# Altium schematic sheet Interrupter.SchDoc
size A3
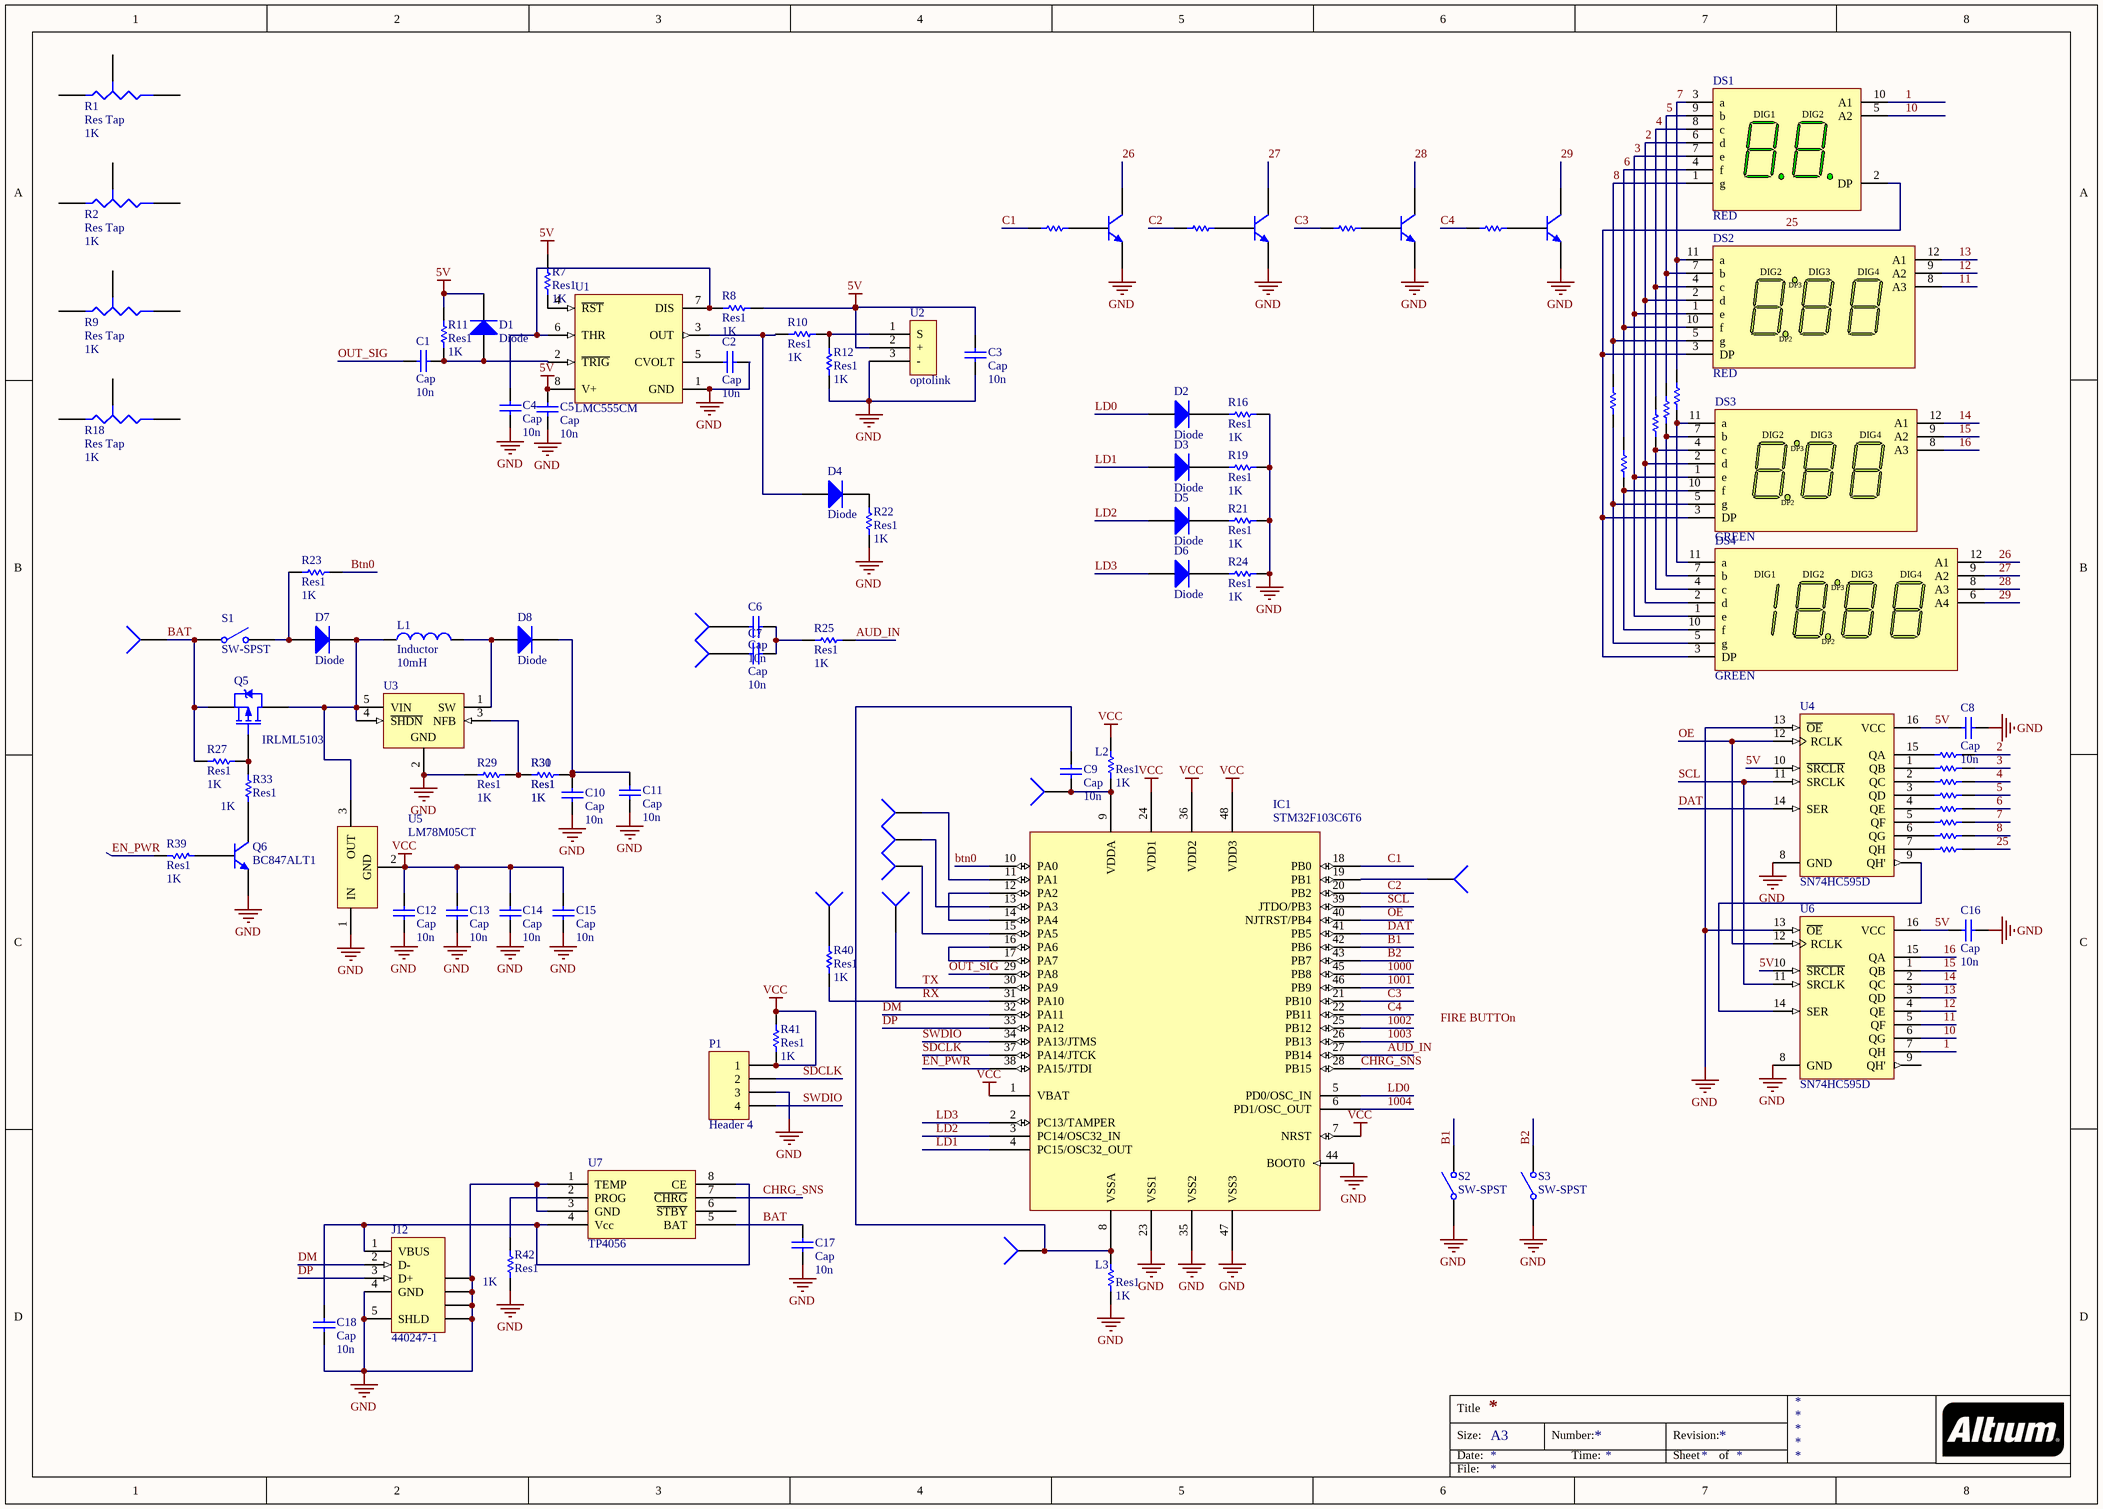
[diagram p0: Interrupter.SchDoc]

## Parts
C1  Cap  value 10n  [0805x]
C2  Cap  value 10n  [ERA-0603]
C3  Cap  value 10n  [1206xx]
C4  Cap  value 10n  [ERA-0603]
C5  Cap  value 10n  [ERA-0603]
C6  Cap  value 10n  [ERA-0603]
C7  Cap  value 10n  [ERA-0603]
C8  Cap  value 10n  [0402]
C9  Cap  value 10n  [0805x]
C10  Cap  value 10n  [1206xx]
C11  Cap  value 10n  [ERA-0603]
C12  Cap  value 10n  [1206x]
C13  Cap  value 10n  [0402]
C14  Cap  value 10n  [0402]
C15  Cap  value 10n  [0402]
C16  Cap  value 10n  [0402]
C17  Cap  value 10n  [1206xx]
C18  Cap  value 10n  [1206xx]
D1  Diode  [SOD80C]
D2  Diode  [LED3mm]
D3  Diode  [LED3mm]
D4  Diode  [LED3mm]
D5  Diode  [LED3mm]
D6  Diode  [LED3mm]
D7  Diode  [SOD80C]
D8  Diode  [SOD80C]
DS1  RED  [HDSM-577]
DS2  RED  [7seg_3x_small]
DS3  GREEN  [7SEG_3X_MEDIUM]
DS4  GREEN  [7seg_4x_small]
IC1  STM32F103C6T6  [TQFP48_N]
J1  Socket  [PAD]  (value not drawn)
J2  Socket  [PAD]  (value not drawn)
J3  Socket  [PAD]  (value not drawn)
J4  Socket  [PAD]  (value not drawn)
J5  Socket  [PAD]  (value not drawn)
J6  Socket  [PAD]  (value not drawn)
J7  Socket  [PAD]  (value not drawn)
J8  Socket  [PAD]  (value not drawn)
J9  Socket  [PAD]  (value not drawn)
J10  Socket  [PAD]  (value not drawn)
J11  Socket  [PAD]  (value not drawn)
J12  440247-1  [440247]
L1  Inductor  value 10mH  [IND_SMD_1]
L2  Res1  value 1K  [ERA-0603]
L3  Res1  value 1K  [ERA-0603]
P1  Header 4  [MHDR1X4]
Q1  BC847ALT1  [318-08]  (value not drawn)
Q2  BC847ALT1  [318-08]  (value not drawn)
Q3  BC847ALT1  [318-08]  (value not drawn)
Q4  BC847ALT1  [318-08]  (value not drawn)
Q5  IRLML5103  [SOT-23_N]
Q6  BC847ALT1  [318-08]
R1  Res Tap  value 1K  [RES_VAR_MEDIUM]
R2  Res Tap  value 1K  [RES_VAR_MEDIUM]
R3  Res1  [ERA-0603]  (value not drawn)
R4  Res1  [ERA-0603]  (value not drawn)
R5  Res1  [ERA-0603]  (value not drawn)
R6  Res1  [ERA-0603]  (value not drawn)
R7  Res1  value 1K  [ERA-0603]
R8  Res1  value 1K  [ERA-0603]
R9  Res Tap  value 1K  [RES_VAR_MEDIUM]
R10  Res1  value 1K  [ERA-0603]
R11  Res1  value 1K  [0805x]
R12  Res1  value 1K  [ERA-0603]
R13  Res1  [1206x]  (value not drawn)
R14  Res1  [1206x]  (value not drawn)
R15  Res1  [1206x]  (value not drawn)
R16  Res1  value 1K  [ERA-0603]
R17  Res1  [1206x]  (value not drawn)
R18  Res Tap  value 1K  [RES_VAR_MEDIUM]
R19  Res1  value 1K  [ERA-0603]
R20  Res1  [1206x]  (value not drawn)
R21  Res1  value 1K  [ERA-0603]
R22  Res1  value 1K  [ERA-0603]
R23  Res1  value 1K  [ERA-0603]
R24  Res1  value 1K  [ERA-0603]
R25  Res1  value 1K  [0402]
R26  Res1  [0805x]  (value not drawn)
R27  Res1  value 1K  [ERA-0603]
R28  Res1  [ERA-0603]  (value not drawn)
R29  Res1  value 1K  [0402]
R30  Res1  value 1K  [0402]
R31  Res1  value 1K  [0402]
R32  Res1  [ERA-0603]  (value not drawn)
R33  Res1  value 1K  [ERA-0603]
R34  Res1  [ERA-0603]  (value not drawn)
R35  Res1  [ERA-0603]  (value not drawn)
R36  Res1  [0805x]  (value not drawn)
R37  Res1  [ERA-0603]  (value not drawn)
R38  Res1  [ERA-0603]  (value not drawn)
R39  Res1  value 1K  [ERA-0603]
R40  Res1  value 1K  [0402]
R41  Res1  value 1K  [ERA-0603]
R42  Res1  value 1K  [ERA-0603]
S1  SW-SPST  [BTN_STD]
S2  SW-SPST  [BTN_STD]
S3  SW-SPST  [BTN_STD]
U1  LMC555CM  [M08A_N]
U2  optolink  [optolink]
U3  LT1931AES5#TR  [S5-T_N]  (value not drawn)
U4  SN74HC595D  [D016_N]
U5  LM78M05CT  [318-08]
U6  SN74HC595D  [D016_N]
U7  TP4056  [NSO8_N]

## Nets
5V: C3.1 C5.1 C8.1 C16.1 D1.2(K) R7.2 R8.1 R11.2 U1.8(V+) U2.2(+) U4.10(~{SRCLR}) U4.16(VCC) U6.10(~{SRCLR}) U6.16(VCC)
GND: C2.1 C3.2 C4.2 C5.2 C8.2 C10.2 C11.2 C12.2 C13.2 C14.2 C15.2 C16.2 C17.2 C18.2 IC1.23(VSS1) IC1.35(VSS2) IC1.44(BOOT0) IC1.47(VSS3) J12.4(GND) J12.5(SHLD) J12.6(SHLD) J12.7(SHLD) J12.8(SHLD) J12.9(SHLD) L3.1 P1.3 Q1.2(E) Q2.2(E) Q3.2(E) Q4.2(E) Q6.2(E) R12.1 R16.2 R19.2 R21.2 R22.1 R24.2 R29.1 R42.1 S2.1(COMMON) S3.1(COMMON) U1.1(GND) U2.3(-) U3.2(GND) U4.8(GND) U4.13(~{OE}) U5.1(IN) U6.8(GND) U6.13(~{OE}) U7.1(TEMP) U7.3(GND)
VCC: C12.1 C13.1 C14.1 C15.1 IC1.1(VBAT) IC1.7(NRST) IC1.24(VDD1) IC1.36(VDD2) IC1.48(VDD3) L2.2 P1.1 R41.1 R41.2 U5.2(GND)
1: DS1.10(A1) U6.7(QH)
2: DS1.6(d) DS2.2(d) DS3.2(d) DS4.2(d) R26.2
3: DS1.7(e) DS2.1(e) DS3.1(e) DS4.1(e) R28.2
4: DS1.8(c) DS2.4(c) R17.2 R32.2
5: DS1.9(b) DS2.7(b) R15.2 R34.2
6: DS1.4(f) DS2.10(f) R20.2 R35.2
7: DS1.3(a) DS2.11(a) R13.2 R36.2
8: DS1.1(g) DS2.5(g) R14.2 R37.2
10: DS1.5(A2) U6.6(QG)
11: DS2.8(A3) U6.5(QF)
12: DS2.9(A2) U6.4(QE)
13: DS2.12(A1) U6.3(QD)
14: DS3.12(A1) U6.2(QC)
15: DS3.9(A2) U6.1(QB)
16: DS3.8(A3) U6.15(QA)
25: DS1.2(DP) DS2.3(DP) DS3.3(DP) DS4.3(DP) R38.2
26: DS4.12(A1) Q1.3(C)
27: DS4.9(A2) Q2.3(C)
28: DS4.8(A3) Q3.3(C)
29: DS4.6(A4) Q4.3(C)
1000: IC1.45(PB8)
1001: IC1.46(PB9)
1002: IC1.25(PB12)
1003: IC1.26(PB13)
1004: IC1.6(PD1/OSC_OUT)
AUD_IN: IC1.27(PB14) R25.2
B1: IC1.42(PB6) S2.2(NO)
B2: IC1.43(PB7) S3.2(NO)
BAT: C17.1 J2.1 Q5.2(S) R27.1 S1.1(COMMON) U7.5(BAT)
Btn0: IC1.10(PA0) R23.2
C1: IC1.18(PB0) R3.1
C2: IC1.20(PB2) R4.1
C3: IC1.21(PB10) R5.1
C4: IC1.22(PB11) R6.1
CHRG_SNS: IC1.28(PB15) U7.7(~{CHRG})
DAT: IC1.41(PB5) U4.14(SER)
DM: IC1.32(PA11) J12.2(D-)
DP: IC1.33(PA12) J12.3(D+)
EN_PWR: IC1.38(PA15/JTDI) R39.2
LD0: D2.1(A) IC1.5(PD0/OSC_IN)
LD1: D3.1(A) IC1.4(PC15/OSC32_OUT)
LD2: D5.1(A) IC1.3(PC14/OSC32_IN)
LD3: D6.1(A) IC1.2(PC13/TAMPER)
OE: IC1.40(NJTRST/PB4) U4.12(RCLK) U6.12(RCLK)
OUT_SIG: C1.2 IC1.29(PA8)
RX: IC1.31(PA10) R40.1
SCL: IC1.39(JTDO/PB3) U4.11(SRCLK) U6.11(SRCLK)
SDCLK: IC1.37(PA14/JTCK) P1.2
SWDIO: IC1.34(PA13/JTMS) P1.4
TX: IC1.30(PA9) J10.1
NetC1_1: C1.1 D1.1(A) R11.1 U1.2(~{TRIG})
NetC2_2: C2.2 U1.5(CVOLT)
NetC4_1: C4.1 R8.2 U1.6(THR) U1.7(DIS)
NetC6_1: C6.1 J1.1
NetC6_2: C6.2 C7.2 R25.1
NetC7_1: C7.1 J3.1
NetC9_1: C9.1 IC1.8(VSSA) J11.1 L3.2
NetC9_2: C9.2 IC1.9(VDDA) J4.1 L2.1
NetC10_1: C10.1 C11.1 D8.2(K) R30.2 R31.2
NetC18_1: C18.1 J12.1(VBUS) U7.4(Vcc) U7.8(CE)
NetD2_2: D2.2(K) R16.1
NetD3_2: D3.2(K) R19.1
NetD4_1: D4.1(A) R10.2 U1.3(OUT)
NetD4_2: D4.2(K) R22.2
NetD5_2: D5.2(K) R21.1
NetD6_2: D6.2(K) R24.1
NetD7_1: D7.1(A) R23.1 S1.2(NO)
NetD7_2: D7.2(K) L1.1 Q5.3(D) U3.4(~{SHDN}) U3.5(VIN) U5.3(OUT)
NetD8_1: D8.1(A) L1.2 U3.1(SW)
NetDS3_4: DS3.4(c) DS4.4(c) R17.1
NetDS3_5: DS3.5(g) DS4.5(g) R14.1
NetDS3_7: DS3.7(b) DS4.7(b) R15.1
NetDS3_10: DS3.10(f) DS4.10(f) R20.1
NetDS3_11: DS3.11(a) DS4.11(a) R13.1
NetIC1_11: IC1.11(PA1) J5.1
NetIC1_12: IC1.12(PA2) IC1.14(PA4)
NetIC1_13: IC1.13(PA3) J6.1
NetIC1_15: IC1.15(PA5) J7.1
NetIC1_16: IC1.16(PA6) IC1.17(PA7)
NetIC1_19: IC1.19(PB1) J8.1
NetJ9_1: J9.1 R40.2
NetQ1_1: Q1.1(B) R3.2
NetQ2_1: Q2.1(B) R4.2
NetQ3_1: Q3.1(B) R5.2
NetQ4_1: Q4.1(B) R6.2
NetQ5_1: Q5.1(G) R27.2 R33.2
NetQ6_1: Q6.1(B) R39.1
NetQ6_3: Q6.3(C) R33.1
NetR7_1: R7.1 U1.4(~{RST})
NetR10_1: R10.1 R12.2 U2.1(S)
NetR26_1: R26.1 U4.15(QA)
NetR28_1: R28.1 U4.1(QB)
NetR29_2: R29.2 R30.1 R31.1 U3.3(NFB)
NetR32_1: R32.1 U4.2(QC)
NetR34_1: R34.1 U4.3(QD)
NetR35_1: R35.1 U4.4(QE)
NetR36_1: R36.1 U4.5(QF)
NetR37_1: R37.1 U4.6(QG)
NetR38_1: R38.1 U4.7(QH)
NetR42_2: R42.2 U7.2(PROG)
NetU4_9: U4.9(QH') U6.14(SER)

Not connected (* = marked no-connect by the designer): R1 1(A) 2(B) 3(TAP); R2 1(A) 2(B) 3(TAP); R9 1(A) 2(B) 3(TAP); R18 1(A) 2(B) 3(TAP); U6 9(QH'); U7 6(~{STBY})

## Notes on the sheet
- Labels drawn without touching a wire or pin: FIRE BUTTOn
- Title
- Size:
- Date:
- A3
- Number:
- Time:
- Revision:
- Sheet
- of
- File:
- (in symbol HDSM-577G) DIG1; DIG2
- (in symbol HDSP-B42G) DIG1; DIG2; DIG3; DIG4; DP3; DP2

## Library data of the parts
C1-C18 = Cap: Capacitor; Published: 8-Jun-2000; LatestRevisionDate: 17-Jul-2002; LatestRevisionNote: Re-released for DXP Platform.; PackageReference: RAD-0.3; Publisher: Altium Limited; PackageDescription: Radial Cap, Thru-Hole; 2 Leads; 0.3 in Pin Spacing
D1-D8 = Diode: Default Diode; Published: 8-Jun-2000; LatestRevisionDate: 17-Jul-2002; LatestRevisionNote: Re-released for DXP Platform.; PackageVersion: Sep-1996; PackageReference: SMC; Publisher: Altium Limited; PackageDescription: DO-214-AB/SMC; 2 C-Bend Leads; Body 7.9 x 5.9 mm, inc. leads (LxW); Code_JEDEC: DO-214-AB
DS1 = HDSM-577G: 9.2 mm Green 7-Segment Display: 2-Digit, RH DP; LuminousIntensity: 1100 ucd (Minimum).; Published: 26-May-2004; LatestRevisionDate: 11-Oct-2004; LatestRevisionNote: Display outline superimposed on PCB Footprint.; DatasheetDocument: 14-Mar-2003; PackageDocument: 14-Mar-2003; PackageReference: HDSM-577; Publisher: Altium Limited; LED_Colour: Green; ComponentLink1Description: Manufacturer Link; ComponentLink1URL: http://www.agilent.com/
DS2-DS4 = HDSP-B42G: 14.22 mm Tinted Green, 18:88 4-Digit 7-Segment Display: CA, Neutral Gray Surface; LuminousIntensity: 2000 ucd (Minimum).; Published: 26-May-2004; LatestRevisionDate: 11-Oct-2004; LatestRevisionNote: Display outline superimposed on PCB Footprint.; DatasheetVersion: 20-Nov-2001; PackageVersion: 20-Nov-2001; PackageReference: HDSP-B4; Publisher: Altium Limited; PackageDescription: LED, 7-Segment Display, 14.22 mm, Four Digit, 18:88; 12 Leads; Row Space 15.24 mm; Pitch 2.54 mm; LED_Colour: Green; ComponentLink1Description: Manufacturer Link; ComponentLink1URL: http://www.agilent.com/; ComponentLink2Description: Datasheet; ComponentLink2URL: http://cp.literature.agilent.com/litweb/pdf/5988-4820EN.pdf
IC1 = STM32F103C6T6: Manufacturer: ST; Farnell: 1447635; Manufacturer Part Number: STM32F103C6T6
J12 = 440247-1: USB 2.0, Right Angle, SMT, B Type, Receptacle, 5 Position, Black; ContactMaterial: Copper Alloy; ContactPlating: Gold (30); PCB_Layout: Complies with manufacturer's recommendation.; DrillSize: Corresponds to nominal value.; PanelGround: Without; Published: 15-Jul-2004; DatasheetDocument: 27-Jun-2003; PackageDocument: 27-Jun-2003; PackageReference: 440247; Publisher: Altium Limited; HousingMaterial: Thermoplastic; ComponentLink1Description: Manufacturer Link; ComponentLink1URL: http://www.tycoelectronics.com/; ComponentLink2Description: Packaging Specification; ComponentLink2URL: http://ecommas.tycoelectronics.com/commerce/DocumentDelivery/DDEController?Action=showdoc&DocId=Customer+Drawing%7F440247%7FD%7Fpdf%7FEnglish%7FC_440247_D.pdf
L1 = Inductor: Code_IEC: 1005; Published: 8-Jun-2000; LatestRevisionDate: 29-May-2009; LatestRevisionNote: IPC-7351 Footprint Added.; PackageReference: 0402-A; Publisher: Altium Limited; PackageDescription: Chip Inductor; Code_JEITA: 0402
L2 L3 R7 R8 R10-R12 R16 R19 R21-R25 R27 R29-R31 R33 R39-R42 = Res1: Resistor; Published: 8-Jun-2000; LatestRevisionDate: 17-Jul-2002; LatestRevisionNote: Re-released for DXP Platform.; PackageReference: AXIAL-0.3; Publisher: Altium Limited; PackageDescription: Axial Device, Thru-Hole; 2 Leads; 0.3 in Pin Spacing
P1 = Header 4: Header, 4-Pin; LatestRevisionDate: 17-Jul-2002; LatestRevisionNote: Re-released for DXP Platform.; Publisher: Altium Limited
Q1-Q4 Q6 = BC847ALT1: General Purpose Transistor NPN Silicon; Published: 29-Sep-2000; LatestRevisionDate: 17-Jul-2002; LatestRevisionNote: Re-released for DXP Platform.; DatasheetVersion: 1997; PackageVersion: 1997; PackageReference: 318-08; Publisher: Altium Limited; PackageDescription: SOT-23; 3 Leads; Body 3.0 x 2.6 mm, inc. leads (LxW max); ComponentLink1Description: Manufacturer Link; ComponentLink1URL: http://www.onsemi.com/site/products/landing?taxonomyID=194; ComponentLink2Description: Datasheet; ComponentLink2URL: http://www.onsemi.com/pub/Collateral/BC846ALT1-D.PDF
Q5 = IRLML5103: HEXFET Power MOSFET; Published: 8-Jun-2000; LatestRevisionDate: 20-Nov-2009; LatestRevisionNote: IPC-7351 Footprint Added.; DatasheetVersion: Aug-1997; PackageReference: SOT-23; Publisher: Altium Limited; PackageDescription: 3-Pin SOT-23 Package 0.95 mm Pitch, 2.3 mm Lead Span; ComponentLink1Description: Manufacturer Link; ComponentLink1URL: http://www.irf.com/; ComponentLink2Description: Datasheet; ComponentLink2URL: http://www.irf.com/product-info/datasheets/data/irlml5103.pdf
R1 R2 R9 R18 = Res Tap: Tapped Resistor; Sim Note: Enter the Resistance value and the set point into parameter fields.; Set Position: 0.5; Published: 24-Mar-1999; LatestRevisionDate: 17-Jul-2002; LatestRevisionNote: Re-released for DXP Platform.; PackageReference: VR3; Publisher: Altium Limited; PackageDescription: Variable Resistor, Thru-Hole; 3 Leads
R3-R6 R13-R15 R17 R20 R26 R28 R32 R34-R38 = Res1: Resistor; Value: 1K; Published: 8-Jun-2000; LatestRevisionDate: 17-Jul-2002; LatestRevisionNote: Re-released for DXP Platform.; PackageReference: AXIAL-0.3; Publisher: Altium Limited; PackageDescription: Axial Device, Thru-Hole; 2 Leads; 0.3 in Pin Spacing
S1-S3 = SW-SPST: Single-Pole, Single-Throw Switch; Published: 24-Mar-1999; LatestRevisionDate: 17-Jul-2002; LatestRevisionNote: Re-released for DXP Platform.; PackageReference: SPST-2; Publisher: Altium Limited; PackageDescription: Switch; 2 Leads
U1 = LMC555CM: CMOS Timer, 8-pin Narrow SOIC; Manufacturer: National Semiconductor; PackageTopMarking: NSZXTT*LMC*555CM; PowerWise: N; CompType: Analog IC; Published: 4-Dec-2008; DatasheetVersion: May-2006; PackageVersion: revM, May-2009; PackageReference: M08A; Publisher: Altium Limited; PackageDescription: SOIC Narrow, 4.9 x 3.9 x 1.45mm, 8 Lead, 1.27mm Pitch; Supplier 1: Farnell; Supplier Part Number 1: 9493972; PartNumber: LMC555CM; RoHS: N; PinCount: 8; Code_JEDEC: MS-012-AA; Code_IPC: SOIC127P600-8; ComponentLink1Description: LMC555 Datasheet; ComponentLink1URL: http://www.national.com/ds/LM/LMC555.pdf; ComponentLink2Description: LMC555 Web Page; ComponentLink2URL: http://www.national.com/pf/LM/LMC555.html; ComponentLink3Description: M08A Package Page; ComponentLink3URL: http://www.national.com/packaging/folders/m08a.html
U3 = LT1931AES5#TR: 2.2MHz Inverting Current Mode DC/DC Converter; Note: 1640; Published: 6-Jun-2005; LatestRevisionDate: 29-May-2009; LatestRevisionNote: IPC-7351 Footprint Added.; DatasheetVersion: Jun-2001; PackageVersion: 2005; PackageReference: S5-T; Publisher: Altium Limited; PackageDescription: 5-Pin SOT-23 Package 0.95 mm Pitch, 2.8 mm Lead Span; Code_IPC: SOT23-5; ComponentLink1Description: Manufacturer Link; ComponentLink1URL: http://www.linear.com/; ComponentLink2Description: Datasheet; ComponentLink2URL: http://www.linear.com/pc/downloadDocument.do?navId=H0,C1,C1003,C1042,P1863,D3921
U4 U6 = SN74HC595D: 8-Bit Shift Register with 3-State Output Registers; Published: 8-Jun-2000; LatestRevisionDate: 13-Apr-2006; LatestRevisionNote: IPC-7351 Footprint Added.; DatasheetVersion: May-1997; PackageVersion: Jan-1998; PackageReference: D016; Publisher: Altium Limited; PackageDescription: 16-Pin Small Outline Integrated Circuit 1.27 mm Pitch; Code_IPC: SOIC127P600-16; ComponentLink1Description: Manufacturer Link; ComponentLink1URL: http://www.ti.com/; ComponentLink2Description: Datasheet; ComponentLink2URL: http://www-s.ti.com/sc/ds/sn74hc595.pdf
U5 = LM78M05CT: 3-Terminal Positive Voltage Regulators, 3-pin TO-220; Manufacturer: National Semiconductor; PackageTopMarking: NSUZXYTTE#*LM341T-5.0*LM78M05CT; PowerWise: N; CompType: LDO IC; Published: 4-Dec-2008; DatasheetVersion: Aug-2005; PackageVersion: revL, Jan-1992; PackageReference: T03B; Publisher: Altium Limited; PackageDescription: TO-220, Molded, 3 Lead, Straight; Supplier 1: Farnell; Supplier Part Number 1: 4467103; PartNumber: LM78M05CT; RoHS: N; PinCount: 3; ComponentLink1Description: LM78M05 Datasheet; ComponentLink1URL: http://www.national.com/ds/LM/LM78M05.pdf; ComponentLink2Description: LM78M05 Web Page; ComponentLink2URL: http://www.national.com/pf/LM/LM78M05.html; ComponentLink3Description: T03B Package Page; ComponentLink3URL: http://www.national.com/packaging/folders/t03b.html
J1-J11 = Socket: LatestRevisionDate: 17-Jul-2002; LatestRevisionNote: Re-released for DXP Platform.; Publisher: Altium Limited